# EasyEDA schematic SCH_OSHW_BiDi_SDI_Fiber_Converter_V2_2024-11-17.json
TITLE: Sheet_1; REV: 1.0; Date: 2024-01-05; Sheet: 1/1; Drawn By: TheStaticTurtle; Company: Your Company
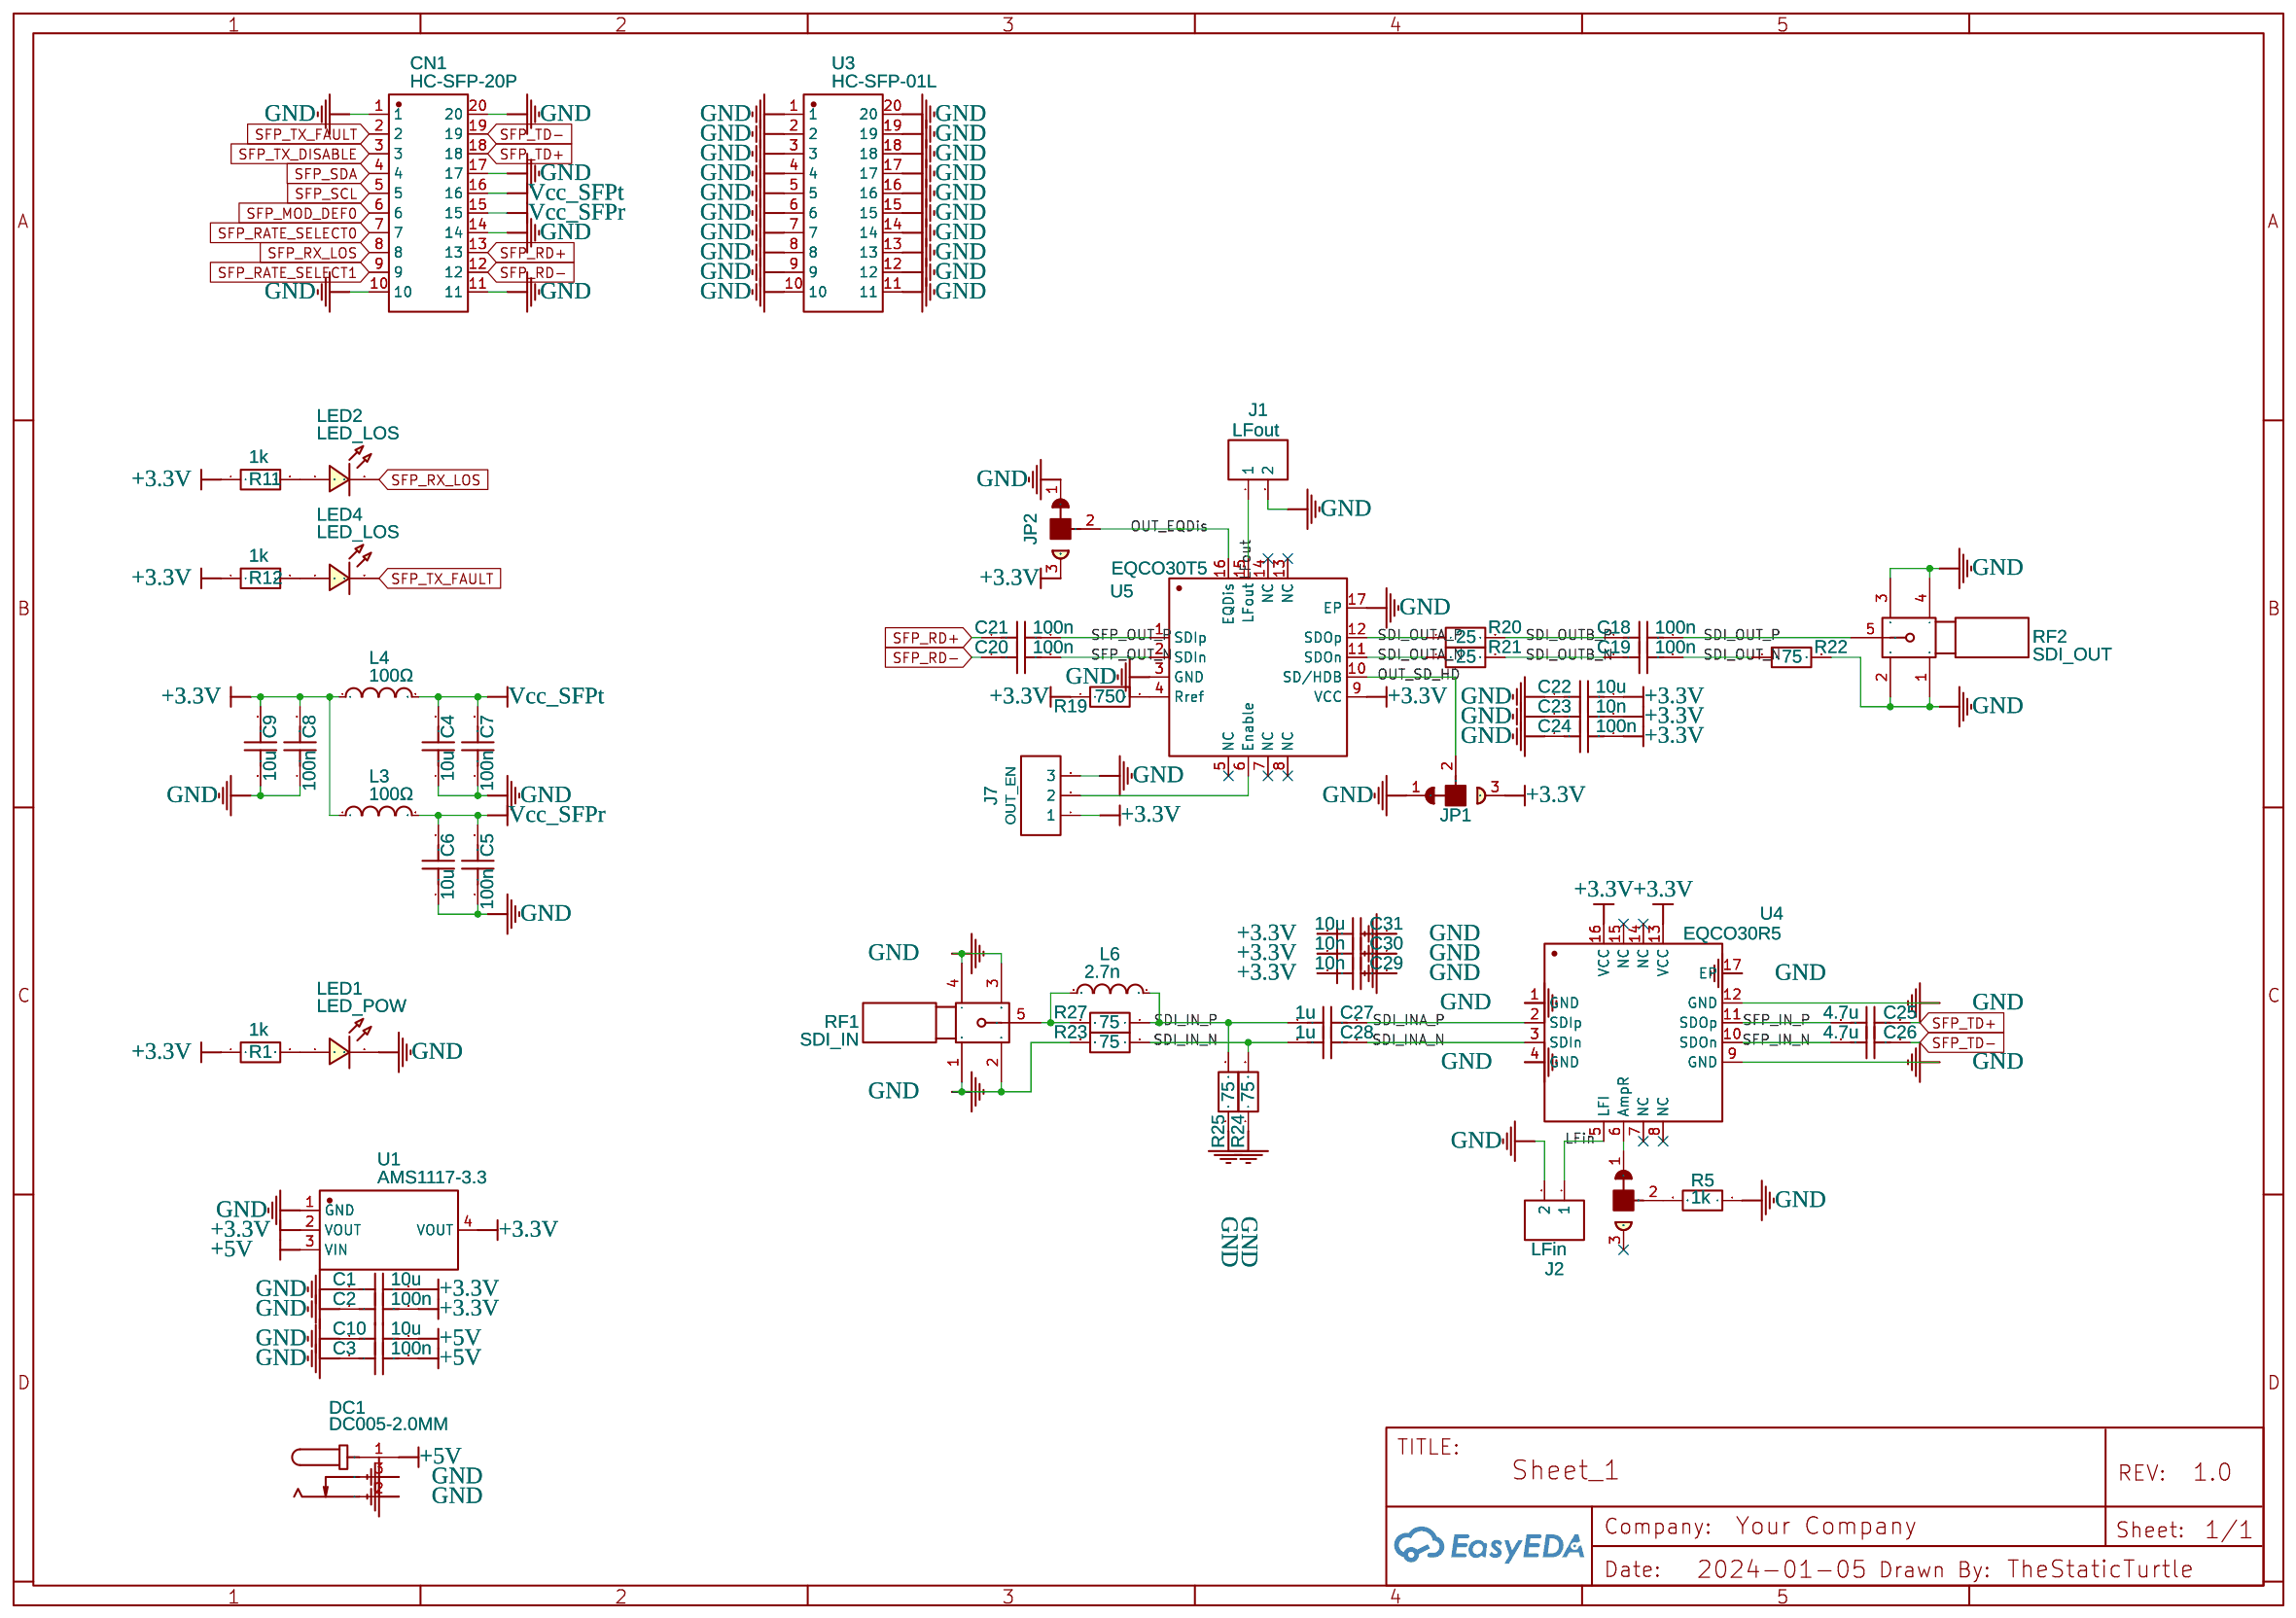
[diagram p0: schematic sheet]

## Parts
C1  10u  [C0603]
C2  100n  [C0603]
C3  100n  [C0603]
C4  10u  [C0603]
C5  100n  [C0603]
C6  10u  [C0603]
C7  100n  [C0603]
C8  100n  [C0603]
C9  10u  [C0603]
C10  10u  [C0603]
C18  100n  [C0603]
C19  100n  [C0603]
C20  100n  [C0603]
C21  100n  [C0603]
C22  10u  [C0603]
C23  10n  [C0603]
C24  100n  [C0603]
C25  4.7u  [C0603]
C26  4.7u  [C0603]
C27  1u  [C0603]
C28  1u  [C0603]
C29  10n  [C0603]
C30  10n  [C0603]
C31  10u  [C0603]
CN1  HC-SFP-20P  [CONN-SMD_20P-P0.80_HCTL_HC-SFP-20P]
DC1  DC005-2.0MM  [DC-IN-TH_DC005]
J1  LFout  [HDR-M-2.54_1X2]
J2  LFin  [HDR-M-2.54_1X2]
J7  OUT_EN  [HDR-M-2.54_1X3]
JP1  SOLDER BRIDGE 3P Bridged  [SOLDER_BRIDGE_3P_BRIDGED]
JP2  SOLDER BRIDGE 3P Bridged  [SOLDER_BRIDGE_3P_BRIDGED]
JP3  SOLDER BRIDGE 3P Bridged  [SOLDER_BRIDGE_3P_BRIDGED]
L3  100Ω  [L0805]
L4  100Ω  [L0805]
L6  2.7n  [L0603]
LED1  LED_POW  [LED0603_RED]
LED2  LED_LOS  [LED0603_RED]
LED4  LED_LOS  [LED0603_RED]
R1  1k  [R0603]
R5  1k  [R0603]
R11  1k  [R0603]
R12  1k  [R0603]
R19  750  [R0603]
R20  25  [R0603]
R21  25  [R0603]
R22  75  [R0603]
R23  75  [R0603]
R24  75  [R0603]
R25  75  [R0603]
R27  75  [R0603]
RF1  SDI_IN  [SMA-SMD_BWSMA-KE-P001]
RF2  SDI_OUT  [SMA-SMD_BWSMA-KE-P001]
U1  AMS1117-3.3  [SOT-223-3_L6.5-W3.4-P2.30-LS7.0-BR]
U3  HC-SFP-01L  [TH_HC-SFP-01L]
U4  EQCO30R5  [QFN16G-0.65-4X4MM]
U5  EQCO30T5  [QFN16G-0.65-4X4MM]

## Library data of the parts
C1-C10 C18-C31 = C_0603_US: Contributor: LCEDA_Lib
CN1 = HC-SFP-20P: Contributor: LCSC; Supplier: LCSC; Supplier Part: C2897291; Manufacturer: HCTL(华灿天禄); JLCPCB Part Class: Extended Part
DC1 = DC005-2.0MM: Supplier: LCSC; Manufacturer: SOFNG; Supplier Part: C111567
J1 J2 = HDR-M-2.54_1x2: Supplier Part: C124375; Supplier: LCSC; Contributor: LCEDA_Lib
J7 = HDR-M-2.54_1x3: Supplier Part: C180248; Supplier: LCSC; Contributor: LCEDA_Lib
JP1-JP3 = SOLDER BRIDGE: Contributor: softmachine
L3 L4 = GZ2012D101TF: Supplier: LCSC; Manufacturer: Sunlord(顺络); Supplier Part: C1015; JLCPCB Part Class: Basic Part
L6 = L0603_US: Contributor: LCEDA_Lib
LED1 LED2 LED4 = LED-0603_R: Manufacturer: EVERLIGHT(台湾亿光); Manufacturer Part: 19-217/R6C-AL1M2VY/3T; Supplier Part: C72044; Supplier: LCSC; Contributor: LCEDA_01
R1 R5 R11 R12 R19-R25 R27 = R_0603_EU: Contributor: LCEDA_Lib
RF1 RF2 = BWSMA-KE-P001: Supplier: LCSC; Supplier Part: C496550; Manufacturer: BAT WIRELESS; Contributor: ytahn23
U1 = AMS1117-3.3: sourceId: dwIGgezVh; Supplier: LCSC; Manufacturer: AMS; Supplier Part: C6186; JLCPCB Part Class: Basic Part
U3 = HC-SFP-01L: Contributor: LCSC; Supplier: LCSC; Supplier Part: C2897292; Manufacturer: HCTL(华灿天禄); JLCPCB Part Class: Extended Part
U4 = EQCO30R5: Manufacturer: Microchip; link: https://www.microchip.com/en-us/product/eqco30r5; Contributor: turtleforgaming
U5 = EQCO30T5: Manufacturer: Microchip; link: https://www.microchip.com/en-us/product/eqco30r5; Contributor: turtleforgaming

## Nets
+3.3V: C1.2 C2.2 C8.2 C9.2 C22.2 C23.2 C24.2 C29.2 C30.2 C31.2 J7.1 JP1.3 JP2.3 L3.1 L4.1 R1.1 R11.1 R12.1 R19.1 U1.2(VOUT) U1.4(VOUT) U4.13(VCC) U4.16(VCC) U5.9(VCC)
+5V: C3.2 C10.2 DC1.1 U1.3(VIN)
GND: C1.1 C2.1 C3.1 C4.1 C5.1 C6.1 C7.1 C8.1 C9.1 C10.1 C22.1 C23.1 C24.1 C29.1 C30.1 C31.1 CN1.1 CN1.10 CN1.11 CN1.14 CN1.17 CN1.20 DC1.2 DC1.3 J1.2 J2.2 J7.3 JP1.1 JP2.1 LED1.2 R5.1 R22.2 R23.2 R24.1 R25.1 RF1.1 RF1.2 RF1.3 RF1.4 RF2.1 RF2.2 RF2.3 RF2.4 U1.1(GND) U3.1 U3.2 U3.3 U3.4 U3.5 U3.6 U3.7 U3.8 U3.9 U3.10 U3.11 U3.12 U3.13 U3.14 U3.15 U3.16 U3.17 U3.18 U3.19 U3.20 U4.1(GND) U4.4(GND) U4.9(GND) U4.12(GND) U4.17(EP) U5.3(GND) U5.17(EP)
Vcc_SFPr: C5.2 C6.2 CN1.15 L3.2
Vcc_SFPt: C4.2 C7.2 CN1.16 L4.2
LFin: J2.1 U4.5(LFI)
LFout: J1.1 U5.15(LFout)
OUT_EQDis: JP2.2 U5.16(EQDis)
OUT_SD_HD: JP1.2 U5.10(SD/HDB)
SDI_IN_N: C28.2 R23.1 R24.2
SDI_IN_P: C27.2 L6.1 R25.2 R27.1
SDI_INA_N: C28.1 U4.3(SDIn)
SDI_INA_P: C27.1 U4.2(SDIp)
SDI_OUT_N: C19.2 R22.1
SDI_OUT_P: C18.2 RF2.5
SDI_OUTA_N: R21.1 U5.11(SDOn)
SDI_OUTA_P: R20.1 U5.12(SDOp)
SDI_OUTB_N: C19.1 R21.2
SDI_OUTB_P: C18.1 R20.2
SFP_IN_N: C26.2 U4.10(SDOn)
SFP_IN_P: C25.2 U4.11(SDOp)
SFP_MOD_DEF0: CN1.6
SFP_OUT_N: C20.2 U5.2(SDIn)
SFP_OUT_P: C21.2 U5.1(SDIp)
SFP_RATE_SELECT0: CN1.7
SFP_RATE_SELECT1: CN1.9
SFP_RD+: C21.1 CN1.13
SFP_RD-: C20.1 CN1.12
SFP_RX_LOS: CN1.8 LED2.2
SFP_SCL: CN1.5
SFP_SDA: CN1.4
SFP_TD+: C25.1 CN1.18
SFP_TD-: C26.1 CN1.19
SFP_TX_DISABLE: CN1.3
SFP_TX_FAULT: CN1.2 LED4.2
Net-(J7-2): J7.2 U5.6(Enable)
Net-(JP3-1): JP3.1 U4.6(AmpR)
Net-(JP3-2): JP3.2 R5.2
Net-(L6-2): L6.2 R27.2 RF1.5
Net-(LED1-1): LED1.1 R1.2
Net-(LED2-1): LED2.1 R11.2
Net-(LED4-1): LED4.1 R12.2
Net-(R19-2): R19.2 U5.4(Rref)

Not connected (* = marked no-connect by the designer): JP3 3*; U4 7(NC)* 8(NC)* 14(NC)* 15(NC)*; U5 5(NC)* 7(NC)* 8(NC)* 13(NC)* 14(NC)*
